# Altium schematic sheet MCU.SchDoc: Titel
size A3; ApprovedBy: name; CompanyName: DCI Electronics bv; DrawnBy: KRS; Address1: Nijverheidsstraat 14; Address2: 4458 AV Eindewege; Address3: Phone: +31 (0)113 344880; DocumentNumber: 4; Revision: 2; SheetNumber: 4; SheetTotal: 14; PageSetup: Record=PageOptions|CenterHorizontal=True|CenterVertical=True|PrintScale=1.00|XCorrection=1.00|YCorrection=1.00|PrintKind=1|BorderSize=5000000|LeftOffset=0|BottomOffset=0|Orientation=2|PaperLength=1000|PaperWidth=1000|Scale=100|PaperSource=7|PrintQuality=-4|MediaType=1|DitherType=10|PaperKind=ISO_A4_(210.00_x_297.00_MM)|PrintScaleMode=1; SubTitle: SubTitel; ApprovedDate: 01-01-12
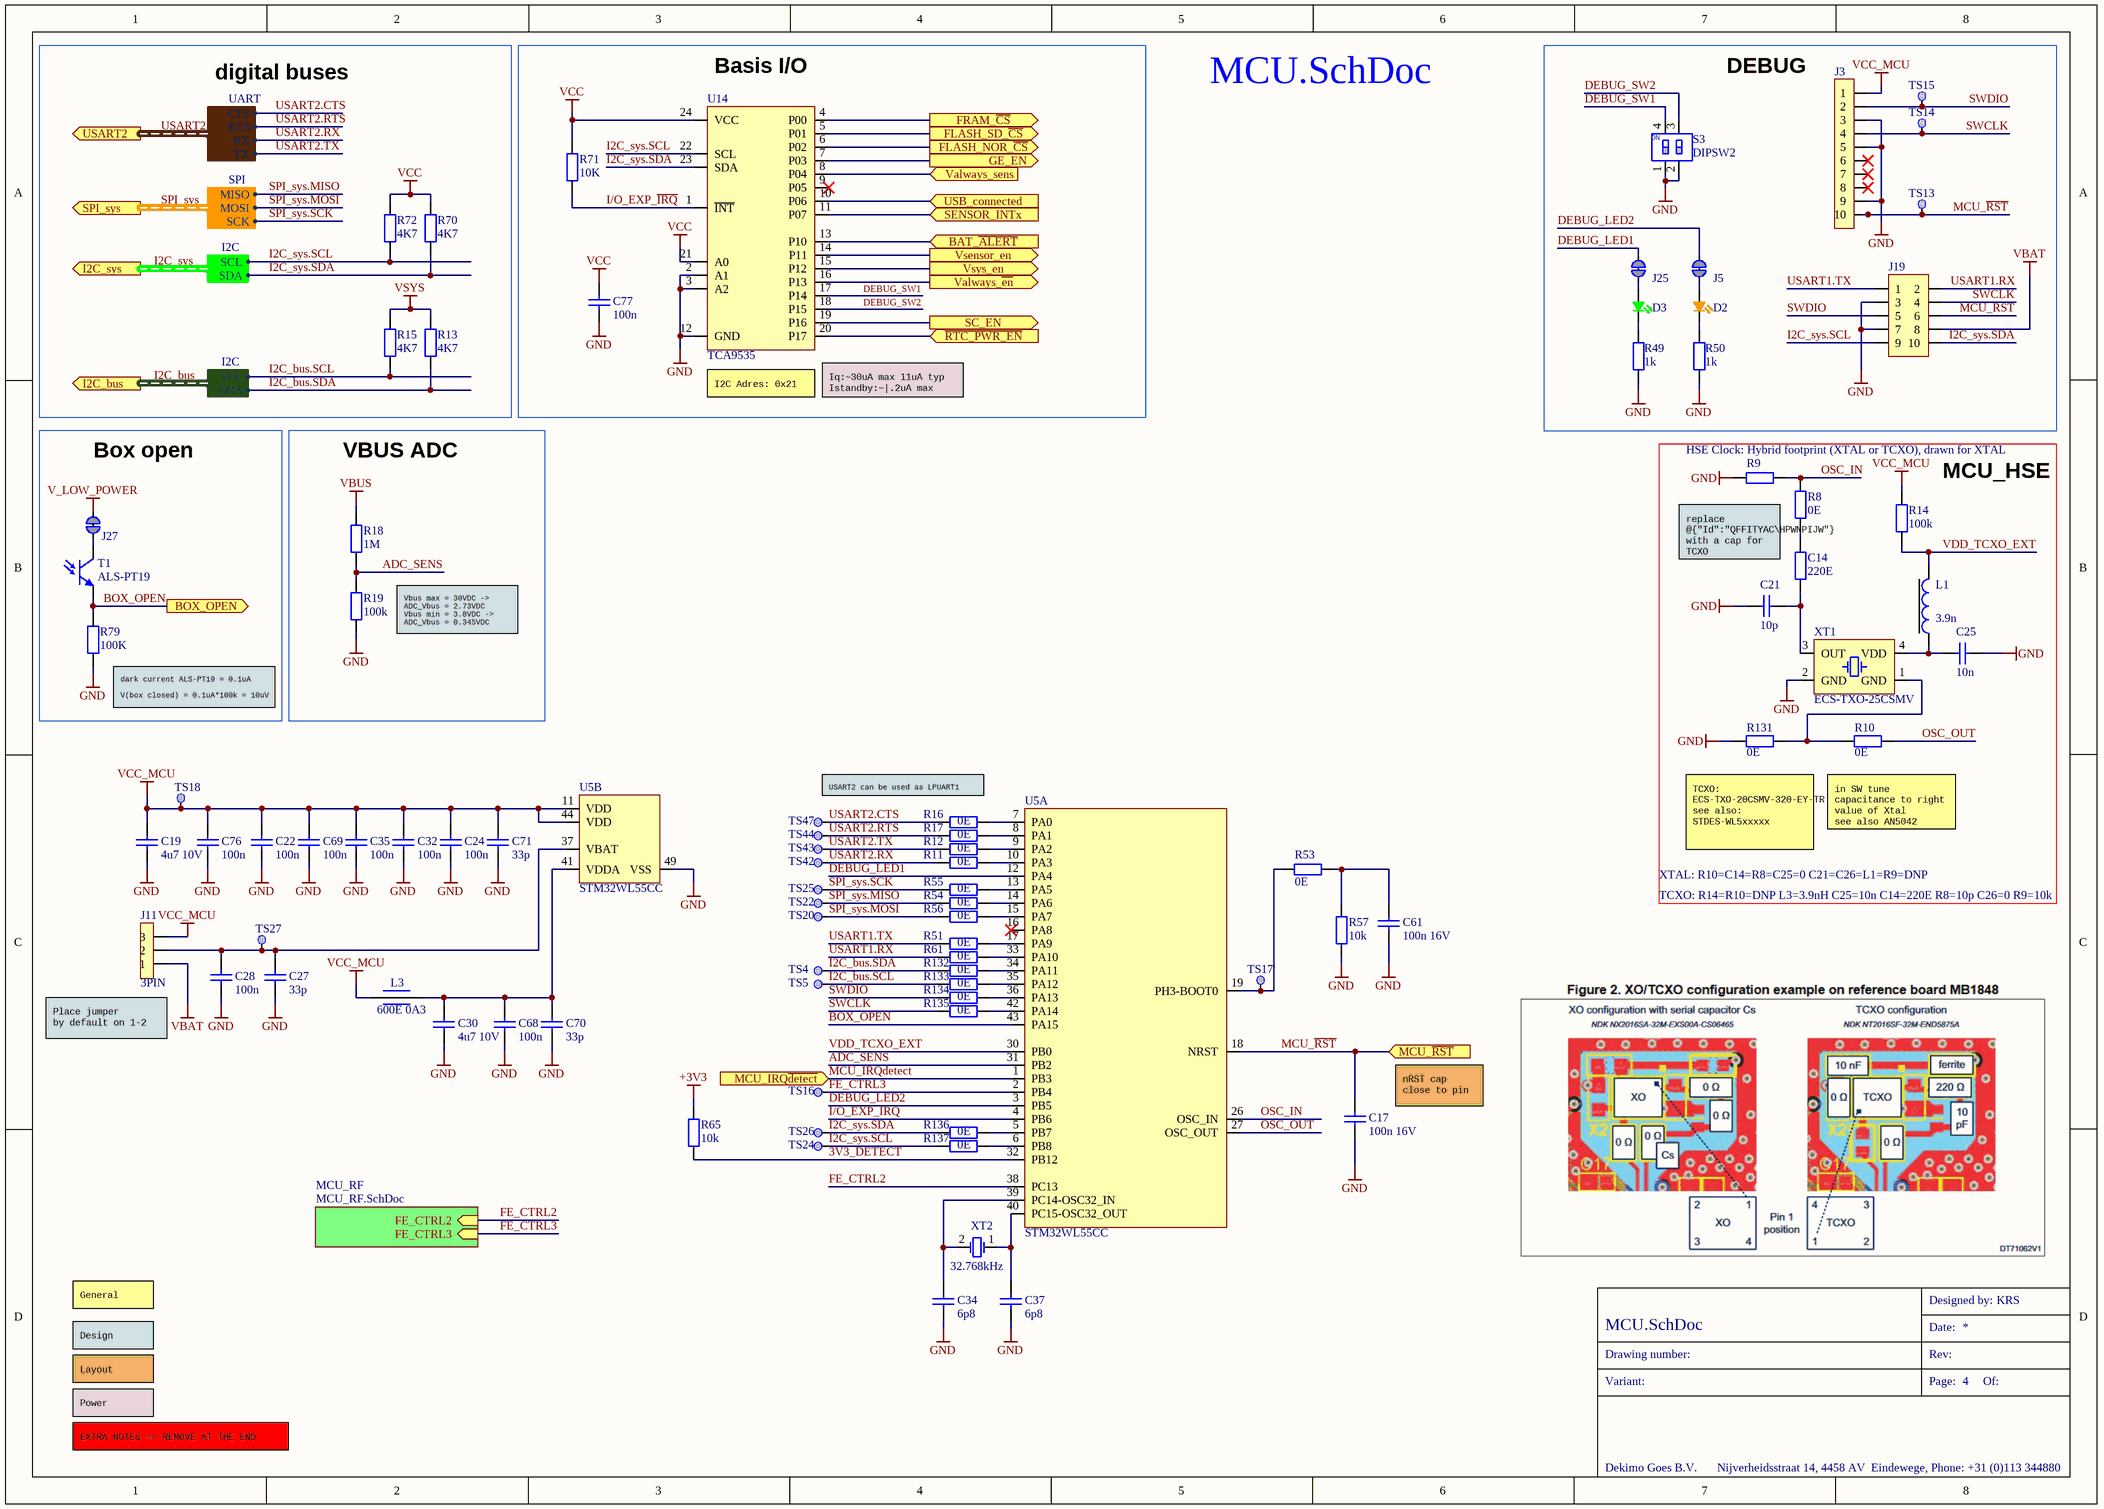
[diagram p0: MCU.SchDoc]

## Parts
C14  220E  [RESC1005X04N]
C17  100n 16V  [CAPC1005X05N]
C19  4u7 10V  [CAPC1608X09N]
C21  10p  [CAPC1005X05N]
C22  100n  [CAPC1005X05N]
C24  100n  [CAP-000G001-002]
C25  10n  [CAP-000G001-002]
C27  33p  [CAP-000G001-002]
C28  100n  [CAP-000G001-002]
C30  4u7 10V  [CAPC1608X09N]
C32  100n  [CAPC1005X05N]
C34  6p8  [CAPC1608X09N]
C35  100n  [CAPC1005X05N]
C37  6p8  [CAPC1608X09N]
C61  100n 16V  [CAPC1005X05N]
C68  100n  [CAPC1005X05N]
C69  100n  [CAPC1005X05N]
C70  33p  [CAP-000G001-002]
C71  33p  [CAPC1005X05N]
C76  100n  [CAPC1005X05N]
C77  100n  [CAPC1608X09N]
D2  (no value)  [LED_0603]
D3  (no value)  [LED_0603_ANODE]
J3  Harwin Archer M50 Series  [PHDR2X5_SMD_P1.27]  (value not drawn)
J5  (no value)  [Solderbridge NC]  (net tie, no BOM)
J11  3PIN  [CON-003G001-003]
J19  (no value)  [PHDR2X5_P2.54]
J25  (no value)  [Solderbridge NC]  (net tie, no BOM)
J27  (no value)  [Solderbridge NC]  (net tie, no BOM)
L1  3.9n  [IND-002G000-002]
L3  600E 0A3  [INDC1608X10N]
R8  0E  [RESC1005X04N]
R9  100E  [RESC1005X04N]  (value not drawn)
R10  0E  [RESC1005X04N]
R11  0E  [RESC1005X04N]
R12  0E  [RESC1005X04N]
R13  4K7  [RESC1005x04N]
R14  100k  [RESC1005X04N]
R15  4K7  [RESC1005x04N]
R16  0E  [RESC1005X04N]
R17  0E  [RESC1005X04N]
R18  1M  [RESC1005x04N]
R19  100k  [RESC1005X04N]
R49  1k  [RESC1608X13N]
R50  1k  [RESC1608X13N]
R51  0E  [RESC1005X04N]
R53  0E  [RESC1005X04N]
R54  0E  [RESC1005X04N]
R55  0E  [RESC1005X04N]
R56  0E  [RESC1005X04N]
R57  10k  [RESC1005X04N]
R61  0E  [RESC1005X04N]
R65  10k  [RESC1005X04N]
R70  4K7  [RESC1005x04N]
R71  10K  [RESC1608X13N]
R72  4K7  [RESC1005x04N]
R79  100K  [RESC1608X13N]
R131  0E  [RESC1005X04N]
R132  0E  [RESC1005X04N]
R133  0E  [RESC1005X04N]
R134  0E  [RESC1005X04N]
R135  0E  [RESC1005X04N]
R136  0E  [RESC1005X04N]
R137  0E  [RESC1005X04N]
S3  DIPSW2  [SW_GDH02S04]
T1  ALS-PT19  [SMD-000G001-002]
TS4  TESTPAD  [TESTPAD 2MM]  (value not drawn)  (no BOM)
TS5  TESTPAD  [TESTPAD 2MM]  (value not drawn)  (no BOM)
TS13  TESTPAD  [TESTPAD 2MM]  (value not drawn)  (no BOM)
TS14  TESTPAD  [TESTPAD 2MM]  (value not drawn)  (no BOM)
TS15  TESTPAD  [TESTPAD 2MM]  (value not drawn)  (no BOM)
TS16  TESTPAD  [TESTPAD 2MM]  (value not drawn)  (no BOM)
TS17  TESTPAD  [TESTPAD 2MM]  (value not drawn)  (no BOM)
TS18  TESTPAD  [TESTPAD 2MM]  (value not drawn)  (no BOM)
TS20  TESTPAD  [TESTPAD 2MM]  (value not drawn)  (no BOM)
TS22  TESTPAD  [TESTPAD 2MM]  (value not drawn)  (no BOM)
TS24  TESTPAD  [TESTPAD 2MM]  (value not drawn)  (no BOM)
TS25  TESTPAD  [TESTPAD 2MM]  (value not drawn)  (no BOM)
TS26  TESTPAD  [TESTPAD 2MM]  (value not drawn)  (no BOM)
TS27  TESTPAD  [TESTPAD 2MM]  (value not drawn)  (no BOM)
TS42  TESTPAD  [TESTPAD 2MM]  (value not drawn)  (no BOM)
TS43  TESTPAD  [TESTPAD 2MM]  (value not drawn)  (no BOM)
TS44  TESTPAD  [TESTPAD 2MM]  (value not drawn)  (no BOM)
TS47  TESTPAD  [TESTPAD 2MM]  (value not drawn)  (no BOM)
U5  STM32WL55CC  [QFN-500G000-048]  (parts A,B of 4)
U14  TCA9535  [SOP-650001-024]
XT1  ECS-TXO-25CSMV  [XTL-001G001-004]
XT2  32.768kHz  [CHIP2PINSM127P600-8N]

## Blocks framed on the sheet
digital buses: R13 R15 R70 R72
Basis I/O: C77 R71 U14
DEBUG: D2 D3 J3 J5 J19 J25 R49 R50 S3 TS13-TS15
Box open: J27 R79 T1
VBUS ADC: R18 R19
MCU_HSE: C14 C21 C25 L1 R8-R10 R14 R131 XT1

## Sub-sheets
MCU_RF = MCU_RF.SchDoc: FE_CTRL2 (in), FE_CTRL3 (in)

## Ports
BAT_~{ALERT} (in), BOX_OPEN (out), FLASH_NOR_~{CS} (out), FLASH_SD_~{CS} (out), FRAM_~{CS} (out), GE_EN (out), I2C_bus (out, harness I2C), I2C_sys (out, harness I2C), MCU_IRQ~{detect} (in), MCU_~{RST} (in), SC_EN (out), SENSOR_INTx (in), SPI_sys (out, harness SPI), USART2 (out, harness UART), USB_connected (in), Valways_sens (in), Valways_~{en} (out), Vsensor_en (out), Vsys_en (out), ~{RTC_PWR_EN} (in)

## Harnesses
SPI: MISO, MOSI, SCK
I2C: SCL, SDA
UART: CTS, RTS, RX, TX

## Nets
+3V3: R65.2
GND: C17.1 C19.1 C21.1 C22.1 C24.1 C25.1 C27.1 C28.1 C30.1 C32.1 C34.1 C35.1 C37.1 C61.1 C68.1 C69.1 C70.1 C71.1 C76.1 C77.1 J3.3 J3.5 J3.9 J19.3 J19.7 R9.1 R19.1 R49.1 R50.1 R57.1 R79.1 R131.1 S3.1(A1) S3.2(A2) U5.49(VSS) U14.2(A1) U14.3(A2) U14.12(GND) XT1.2(GND)
V_LOW_POWER: J27.2
VBAT: J11.1 J19.8
VBUS: R18.1
VCC: C77.2 R70.2 R71.2 R72.2 U14.21(A0) U14.24(VCC)
VCC_MCU: C19.2 C22.2 C24.2 C32.2 C35.2 C69.2 C71.2 C76.2 J3.1 J11.3 L3.1 R14.2 TS18.1(TP) U5.11(VDD) U5.44(VDD)
VSYS: R13.2 R15.2
3V3_DETECT: R65.1 U5.32(PB12)
~{RTC_PWR_EN}: U14.20(P17) ; port ~{RTC_PWR_EN}
ADC_SENS: R18.2 R19.2 U5.31(PB2)
BAT_~{ALERT}: U14.13(P10) ; port BAT_~{ALERT}
BOX_OPEN: R79.2 T1.2 U5.43(PA15) ; port BOX_OPEN
DEBUG_LED1: J25.2 U5.12(PA4)
DEBUG_LED2: J5.2 U5.3(PB5)
DEBUG_SW1: S3.4(B1) U14.17(P14)
DEBUG_SW2: S3.3(B2) U14.18(P15)
FE_CTRL2: U5.38(PC13) ; sheet MCU_RF/FE_CTRL2
FE_CTRL3: TS16.1(TP) U5.2(PB4) ; sheet MCU_RF/FE_CTRL3
FLASH_NOR_~{CS}: U14.6(P02) ; port FLASH_NOR_~{CS}
FLASH_SD_~{CS}: U14.5(P01) ; port FLASH_SD_~{CS}
FRAM_~{CS}: U14.4(P00) ; port FRAM_~{CS}
GE_EN: U14.7(P03) ; port GE_EN
I2C_bus.SCL: R15.1 R133.1 TS5.1(TP) ; port I2C_bus.SCL
I2C_bus.SDA: R13.1 R132.1 TS4.1(TP) ; port I2C_bus.SDA
I2C_sys.SCL: J19.9 R72.1 R137.1 TS24.1(TP) U14.22(SCL) ; port I2C_sys.SCL
I2C_sys.SDA: J19.10 R70.1 R136.1 TS26.1(TP) U14.23(SDA) ; port I2C_sys.SDA
I/O_EXP_~{IRQ}: R71.1 U5.4(PB6) U14.1(~{INT})
MCU_IRQ~{detect}: U5.1(PB3) ; port MCU_IRQ~{detect}
MCU_~{RST}: C17.2 J3.10 J19.6 TS13.1(TP) U5.18(NRST) ; port MCU_~{RST}
OSC_IN: R8.2 R9.2 U5.26(OSC_IN)
OSC_OUT: R10.2 U5.27(OSC_OUT)
SC_EN: U14.19(P16) ; port SC_EN
SENSOR_INTx: U14.11(P07) ; port SENSOR_INTx
SPI_sys.MISO: R54.1 TS22.1(TP) ; port SPI_sys.MISO
SPI_sys.MOSI: R56.1 TS20.1(TP) ; port SPI_sys.MOSI
SPI_sys.SCK: R55.1 TS25.1(TP) ; port SPI_sys.SCK
SWCLK: J3.4 J19.4 R135.1 TS14.1(TP)
SWDIO: J3.2 J19.5 R134.1 TS15.1(TP)
USART1.RX: J19.2 R61.1
USART1.TX: J19.1 R51.1
USART2.CTS: R16.1 TS47.1(TP) ; port USART2.CTS
USART2.RTS: R17.1 TS44.1(TP) ; port USART2.RTS
USART2.RX: R11.1 TS42.1(TP) ; port USART2.RX
USART2.TX: R12.1 TS43.1(TP) ; port USART2.TX
USB_connected: U14.10(P06) ; port USB_connected
Valways_~{en}: U14.16(P13) ; port Valways_~{en}
Valways_sens: U14.8(P04) ; port Valways_sens
VDD_TCXO_EXT: L1.2 R14.1 U5.30(PB0)
Vsensor_en: U14.14(P11) ; port Vsensor_en
Vsys_en: U14.15(P12) ; port Vsys_en
NetC14_1: C14.1 C21.2 XT1.3(OUT)
NetC14_2: C14.2 R8.1
NetC25_2: C25.2 L1.1 XT1.4(VDD)
NetC27_2: C27.2 C28.2 J11.2 TS27.1(TP) U5.37(VBAT)
NetC30_2: C30.2 C68.2 C70.2 L3.2 U5.41(VDDA)
NetC34_2: C34.2 U5.39(PC14-OSC32_IN) XT2.2(OSC2)
NetC37_2: C37.2 U5.40(PC15-OSC32_OUT) XT2.1(OSC1)
NetC61_2: C61.2 R53.1 R57.2
NetD2_A: D2.A J5.1
NetD2_C: D2.C R50.2
NetD3_A: D3.A J25.1
NetD3_C: D3.C R49.2
NetJ27_1: J27.1 T1.1
NetR10_1: R10.1 R131.2 XT1.1(GND)
NetR11_2: R11.2 U5.10(PA3)
NetR12_2: R12.2 U5.9(PA2)
NetR16_2: R16.2 U5.7(PA0)
NetR17_2: R17.2 U5.8(PA1)
NetR51_2: R51.2 U5.17(PA9)
NetR53_2: R53.2 TS17.1(TP) U5.19(PH3-BOOT0)
NetR54_2: R54.2 U5.14(PA6)
NetR55_2: R55.2 U5.13(PA5)
NetR56_2: R56.2 U5.15(PA7)
NetR61_2: R61.2 U5.33(PA10)
NetR132_2: R132.2 U5.34(PA11)
NetR133_2: R133.2 U5.35(PA12)
NetR134_2: R134.2 U5.36(PA13)
NetR135_2: R135.2 U5.42(PA14)
NetR136_2: R136.2 U5.5(PB7)
NetR137_2: R137.2 U5.6(PB8)

Not connected (* = marked no-connect by the designer): J3 6* 7* 8*; U5 16(PA8)*; U14 9(P05)*

## Buses and harness runs
harness I2C_bus = port I2C_bus
harness I2C_sys = port I2C_sys
harness SPI_sys = port SPI_sys
harness USART2 = port USART2

## Notes on the sheet
- (near U14) I2C Adres: 0x21
- (near U14) Iq:~30uA max 11uA typ
  Istandby:~2.2uA max
- HSE Clock: Hybrid footprint (XTAL or TCXO), drawn for XTAL
- replace @{"Id":"QFFITYAC\HPWNPIJW"}  with a cap for TCXO
- Vbus max = 30VDC -> ADC_Vbus = 2.73VDC
  Vbus min = 3.8VDC ->
  ADC_Vbus = 0.345VDC
- (near R79) dark current ALS-PT19 = 0.1uA
  V(box closed) = 0.1uA*100k = 10uV
- USART2 can be used as LPUART1
- TCXO: ECS-TXO-20CSMV-320-EY-TR
  see also: STDES-WL5xxxxx
- (near R10) in SW tune capacitance to right value of Xtal
  see also AN5042
- TCXO: R14=R10=DNP L3=3.9nH C25=10n C14=220E R8=10p C26=0 R9=10k
- XTAL: R10=C14=R8=C25=0 C21=C26=L1=R9=DNP
- (near J11) Place jumper
  by default on 1-2
- (near C17) nRST cap close to pin
- General
- Design
- Layout
- Power
- EXTRA NOTES => REMOVE AT THE END
- Designed by:
- Drawing number:
- Variant:
- Date:
- Page:
- Rev:
- Of:
- Dekimo Goes B.V.
- Nijverheidsstraat 14, 4458 AV  Eindewege, Phone: +31 (0)113 344880
- (in symbol SW DIP2SO/G2) ON

## Library data of the parts
C14 = R 220E/70: 220ohm 62.5mW 1%; EngPartGrpMainCode: RES; ManufactpartCode: MCWR04X2200FTL-MUP; Type: Resistor metalfilm SMD; Preferred: False; SMD_Flag: True; PartCode: R 220E/70
C17 C22 C32 C35 C61 C68 C69 C76 = CKE 100N/70: 100nF, 16V, 10%, X7R; EngPartGrpMainCode: CAP; ManufactpartCode: CC0402KRX7R7BB104-YAG; Type: Capacitor ceramic SMD; Preferred: False; SMD_Flag: True; PartCode: CKE 100N/70
C19 C30 = CKE 4U7V10/60: 4.7uF 10% 10V X5R; EngPartGrpMainCode: CAP; ManufactpartCode: 0603ZD475KAT2A-AVX; Type: Capacitor ceramic SMD; Preferred: False; SMD_Flag: True; PartCode: CKE 4U7V10/60
C21 = CKE 10P/70: 10pF, 50V, 5%, NP0; EngPartGrpMainCode: CAP; ManufactpartCode: CC0402JRNPO9BN100-YAG; Type: Capacitor ceramic SMD; Preferred: False; SMD_Flag: True; PartCode: CKE 10P/70
C24 C28 = CKE 100N/91: 100nF, 10V, X5R; EngPartGrpMainCode: CAP; ManufactpartCode: GRM033R61A104KE15D-MUR; Type: Capacitor ceramic SMD; Preferred: False; SMD_Flag: True; PartCode: CKE 100N/91
C25 = CKE 10N/90: 10nF, 10V, X7R; EngPartGrpMainCode: CAP; ManufactpartCode: C0603X7R1A103K030BA-TDK; Type: Capacitor ceramic SMD; Preferred: False; SMD_Flag: True; PartCode: CKE 10N/90
C27 C70 = CKE 33P/90: 33pF, 25V, 5%; EngPartGrpMainCode: CAP; ManufactpartCode: GJM0335C1E330JB01D-MUR; Type: Capacitor ceramic SMD; Preferred: False; SMD_Flag: True; PartCode: CKE 33P/90
C34 C37 = CKE 6P8/60: 6p8 +-0.5p 25V NP0; EngPartGrpMainCode: CAP; ManufactpartCode: GRM1885C1H6R8DA01D-MUR; Type: Capacitor ceramic SMD; Preferred: False; SMD_Flag: True; PartCode: CKE 6P8/60
C71 = CKE 33P/70: 33pF, 50V, 5%, COG; EngPartGrpMainCode: CAP; ManufactpartCode: 223886915339-YAG; Type: Capacitor ceramic SMD; Preferred: False; SMD_Flag: True; PartCode: CKE 33P/70
C77 = CKE 100N/60: 100nF 50V 10% X7R; EngPartGrpMainCode: CAP; ManufactpartCode: 2238 586 15649-PHI; Type: Capacitor ceramic SMD; Preferred: False; SMD_Flag: True; PartCode: CKE 100N/60
D2 = LED SMDO/3: Led Orange 0603; EngPartGrpMainCode: OPTO; ManufactpartCode: 150060AS75000-WE; Type: LED SMD; Preferred: False; SMD_Flag: True; PartCode: LED SMDO/3
D3 = LED SMDG/16: Led Groen 0603; EngPartGrpMainCode: OPTO; ManufactpartCode: 150060VS75003-WE; Type: LED SMD; Preferred: False; SMD_Flag: True; PartCode: LED SMDG/16
J3 = CON PHDR2X5S/10: pinh 2x5/straight/Au/1.27pitch; EngPartGrpMainCode: CONN; ManufactpartCode: M50-3600542-HAR; Preferred: False; SMD_Flag: True; PartCode: CON PHDR2X5S/10; Type: Connector pinhdr SMD
J5 J25 J27 = SolderbridgeNC: Solderbridge  - Normally Connected
J11 = CON PHDR1X3S/11: pinh 1x3/straight/Au/1.27pitch; EngPartGrpMainCode: CONN; ManufactpartCode: M50-3630342-HAR; Preferred: False; SMD_Flag: True; PartCode: CON PHDR1X3S/11; Type: Connector pinhdr SMD
J19 = CON PHDR2X5S/5: pinh 2x5/straight/h=6.7/Au; EngPartGrpMainCode: CONN; ManufactpartCode: 826632-5-TYC; Remark: CON PHDR2X36S/1 Part; Preferred: False; PartCode: CON PHDR2X5S/5; Type: Connector Pinheader; SMD_Flag: False
L1 = IND 3N9/70: 3.9nH 0.1nH 750mA; EngPartGrpMainCode: IND; ManufactpartCode: LQW15AN3N9B00D-MUR; Type: Inductor choke SMD; Preferred: False; SMD_Flag: True; PartCode: IND 3N9/70
L3 = IND 600E 0A3/1: 600E @100Mhz 0.3A; EngPartGrpMainCode: IND; ManufactpartCode: 742792653-WE; Type: Ferrite bead SMD; Preferred: False; SMD_Flag: True; PartCode: IND 600E 0A3/1
R8 R10-R12 R16 R17 R51 R53-R56 R61 R131-R137 = R 0E/70: 0E, 62.5mW, 1%; PartCode: R 0E/70; EngPartGrpMainCode: RES; ManufactpartCode: RC0402JR-070RL-YAG; Preferred: False; SMD_Flag: True; Type: Resistor metalfilm SMD
R9 = R 100E/70: 100E, 62.5mW, 1%; EngPartGrpMainCode: RES; ManufactpartCode: RC0402FR-07100RL-YAG; Preferred: False; SMD_Flag: True; PartCode: R 100E/70; Type: Resistor metalfilm SMD
R13 R15 R70 R72 = R 4K7/70: 4K7, 62.5mW, 1%; EngPartGrpMainCode: RES; ManufactpartCode: RC0402FR-074K7L-YAG; Preferred: False; SMD_Flag: True; PartCode: R 4K7/70; Type: Resistor metalfilm SMD
R14 R19 = R 100K/70: 100K, 62.5mW, 1%; EngPartGrpMainCode: RES; ManufactpartCode: RC0402FR-07100KL-YAG; Preferred: False; SMD_Flag: True; PartCode: R 100K/70; Type: Resistor metalfilm SMD
R18 = R 1M/70: 1M, 62.5mW, 1%; PartCode: R 1M/70; EngPartGrpMainCode: RES; ManufactpartCode: RC0402FR-071ML-YAG; Preferred: False; SMD_Flag: True; Type: Resistor metalfilm SMD
R49 R50 = R 1K/60: 1K, 100mW, 1%; PartCode: R 1K/60; EngPartGrpMainCode: RES; ManufactpartCode: RC0603FR-071KL-YAG; Preferred: True; Type: Resistor metalfilm SMD; SMD_Flag: True
R57 R65 = R 10K/70: 10K, 62.5mW, 1%; EngPartGrpMainCode: RES; ManufactpartCode: RC0402FR-0710KL-YAG; Preferred: False; SMD_Flag: True; PartCode: R 10K/70; Type: Resistor metalfilm SMD
R71 = R 10K/60: 10k 100mW, 1%; EngPartGrpMainCode: RES; ManufactpartCode: RC0603FR-0710KL-YAG; Preferred: True; PartCode: R 10K/60; Type: Resistor metalfilm SMD; SMD_Flag: True
R79 = R 100K/60: 100k 100mW, 1%; EngPartGrpMainCode: RES; ManufactpartCode: CRG0603F100K-TEC; Preferred: True; PartCode: R 100K/60; Type: Resistor metalfilm SMD; SMD_Flag: True
S3 = SW DIP2SO/G2: DIP,2p,Straight,H=2,3mm,SMD,AU; EngPartGrpMainCode: SWI; ManufactpartCode: GDH02S04-TYC; Preferred: False; SMD_Flag: True; PartCode: SW DIP2SO/G2; Type: Switch slide SMD
T1 = IC ALS-PT19: Ambient Light Sensor; EngPartGrpMainCode: IC; ManufactpartCode: ALS-PT19-315C/L177/TR8-EVE; Remark: Bottom Marking; Type: IC Peripheral SMD; Preferred: False; SMD_Flag: True; PartCode: IC ALS-PT19
TS4 TS5 TS13-TS18 TS20 TS22 TS24-TS27 TS42-TS44 TS47 = TESTPAD-2.0: 0.5mm Testpad SMD; PartCode: TESTPAD-2.0
U5 = IC STM32WL55CC: EngPartGrpMainCode: IC; ManufactpartCode: STM32WL55CCU6-STM; Preferred: False; SMD_Flag: True; PartCode: IC STM32WL55CC; Type: IC microcontroller SMD
U14 = IC TCA9535/SO: 16-bits  I2C I/O Expander; EngPartGrpMainCode: IC; ManufactpartCode: TCA9535PWR-TI; Preferred: False; SMD_Flag: True; PartCode: IC TCA9535/SO; Type: IC Peripheral SMD
XT1 = OSC 32MHZ/2: 32Mhz 1V7-3V465 2x1.6mm; EngPartGrpMainCode: XTAL; ManufactpartCode: ECS-TXO-20CSMV-320-EY-TR-ECS; Preferred: False; SMD_Flag: True; PartCode: OSC 32MHZ/2; Type: Crystal Oscillator SMD
XT2 = XT 32.768KHZ/S2: 32.768kHz 20ppm 12.5pF; ManufactpartCode: FC-135 32.7680KA-A3-EPS; Preferred: False; SMD_Flag: True; PartCode: XT 32.768KHZ/S2; EngPartGrpMainCode: XTAL; Type: Quarz crystal SMD